# EAGLE design I2C SX Link Adaptor (EAGLE 9.6.2)
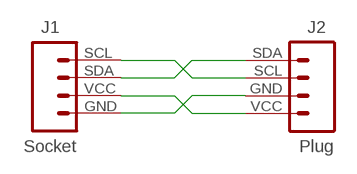
[diagram p0: schematic, sheet 1]

## Parts
J1  Socket  HEADER-1X4-I2C-SX  [CONN_04-I2C-SX]
J2  Plug  HEADER-1X4-I2C  [CONN_04-I2C]

## Nets
N$1: J1.SDA J2.SDA
N$2: J1.SCL J2.SCL
N$3: J1.GND J2.GND
N$5: J1.VCC J2.VCC

## Library data of the parts
J1 = digitalconcepts:HEADER-1X4-I2C-SX: I2C Interface [Pin 1 GND & Pin 3 SDA] 4-Pin Header
J2 = digitalconcepts:HEADER-1X4-I2C: I2C Interface [Pin 1 Vcc] 4-Pin Header

## Board
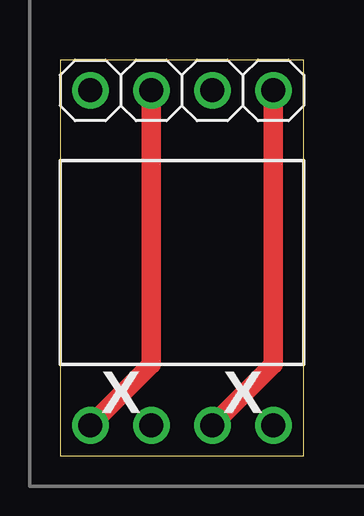
[diagram p1: board, top side]
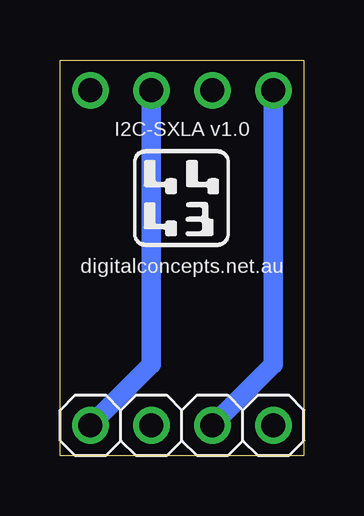
[diagram p2: board, bottom side, seen from below]

Size 10.16 x 16.51 mm. Coordinates in mm from the lower left corner, seen from the top.
Outline: 0,0 10.16,0 10.16,16.51 0,16.51 0,0
Copper layers (1*16): Top 0.035mm / dielectric 1.5mm / Bottom 0.035mm
Design rules "default *": minimum track width 6mil, minimum drill 0.35mm, track to track 6mil, track to pad 6mil, pad to pad 6mil, via to via 6mil, smd to smd 6mil, copper to edge 15mil, drill to drill 6mil, minimum pad ring 10mil, minimum via ring 8mil, stop-mask expansion 4mil, vias tented up to drill 0mil, thermal gap 10mil

### Footprints (pad centres in the part's own frame; a part is rotated, then mirrored left to right if it is on the bottom)
CONN_04-I2C-SX = drill 1 pad 1.524: GND 0,0; SCL 7.62,0; SDA 5.08,0; VCC 2.54,0
CONN_04-I2C = drill 1 pad 1.524: GND 2.54,0; SCL 5.08,0; SDA 7.62,0; VCC 0,0

### Placement (x,y rotation side)
J1  1.27,1.27 180 bottom
J2  1.27,15.24 0 top

### Tracks (layer width: path | path; a pad name or v marks a point on that pad's centre or on a via)
N$1
  Top 0.813: J1.SDA 8.89,3.81 J2.SDA
N$2
  Bottom 0.813: J2.SCL 6.35,3.81 J1.SCL
N$3
  Top 0.813: J2.GND 3.81,3.81 J1.GND
N$5
  Bottom 0.813: J2.VCC 1.27,3.81 J1.VCC

### Text on the board
tPlace: X | X
bPlace: I2C-SXLA v1.0 | digitalconcepts.net.au